# EAGLE schematic FlowControllerNChannel (EAGLE 9.6.2)
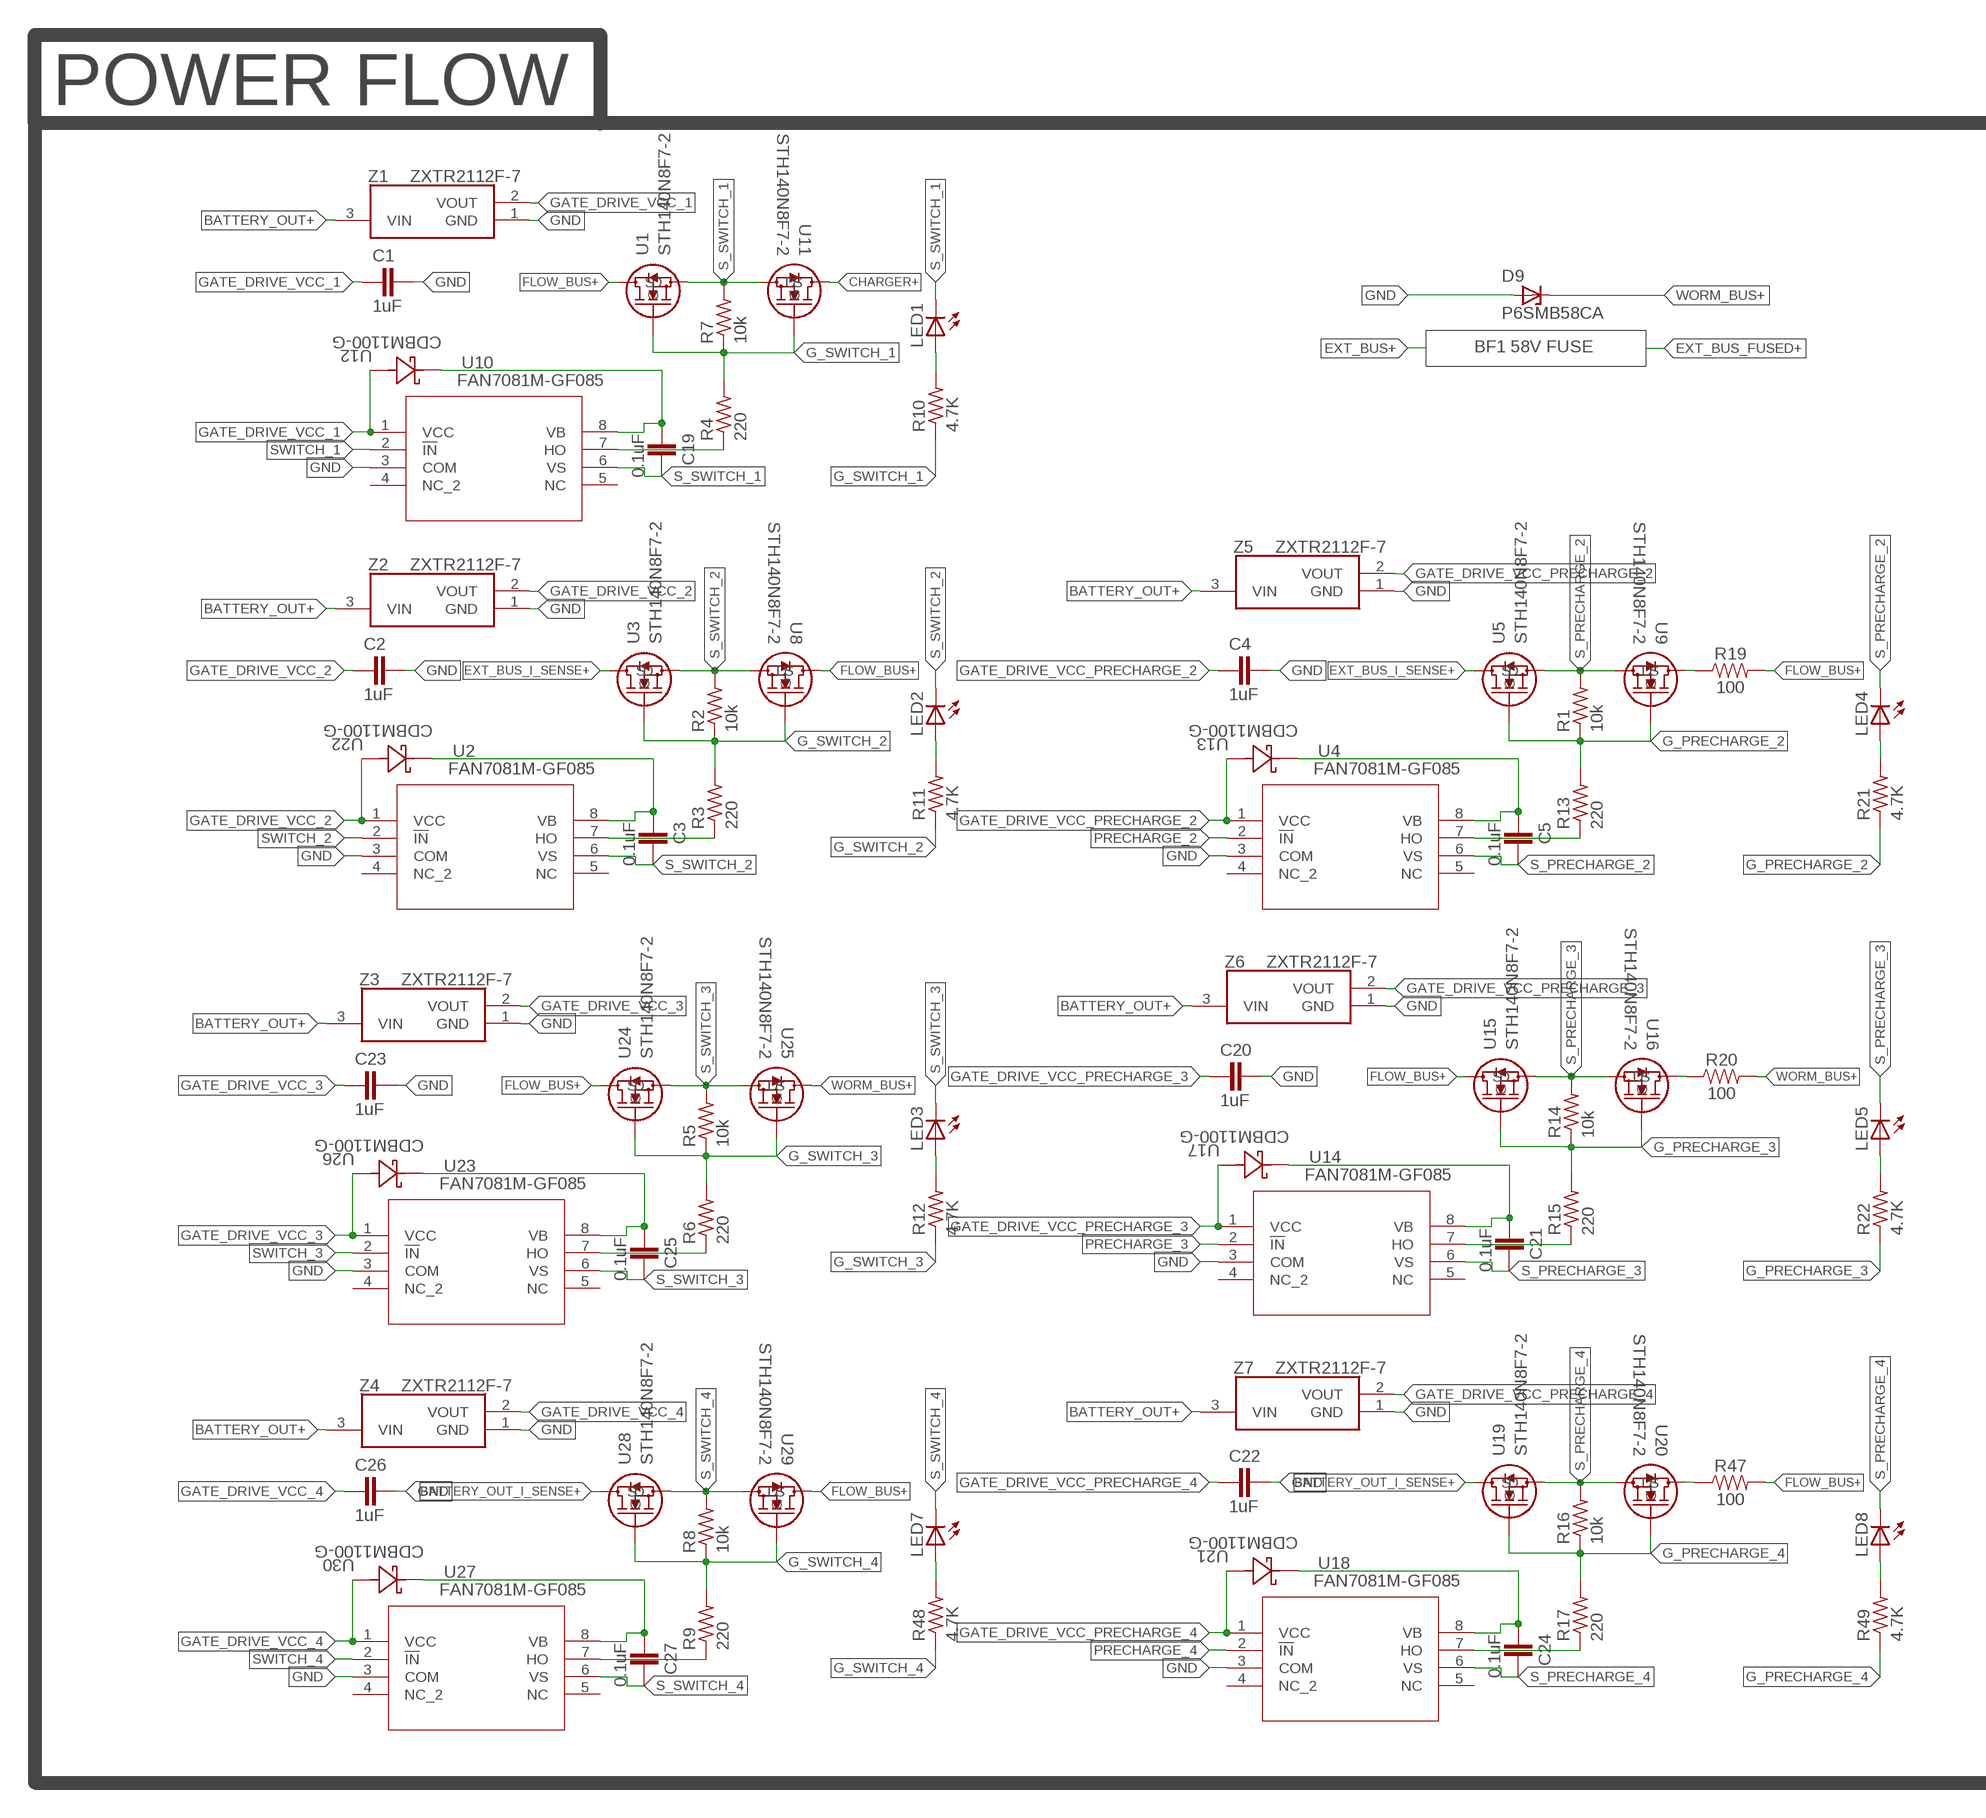
[diagram p0: schematic, sheet 1, part 1 of 2]
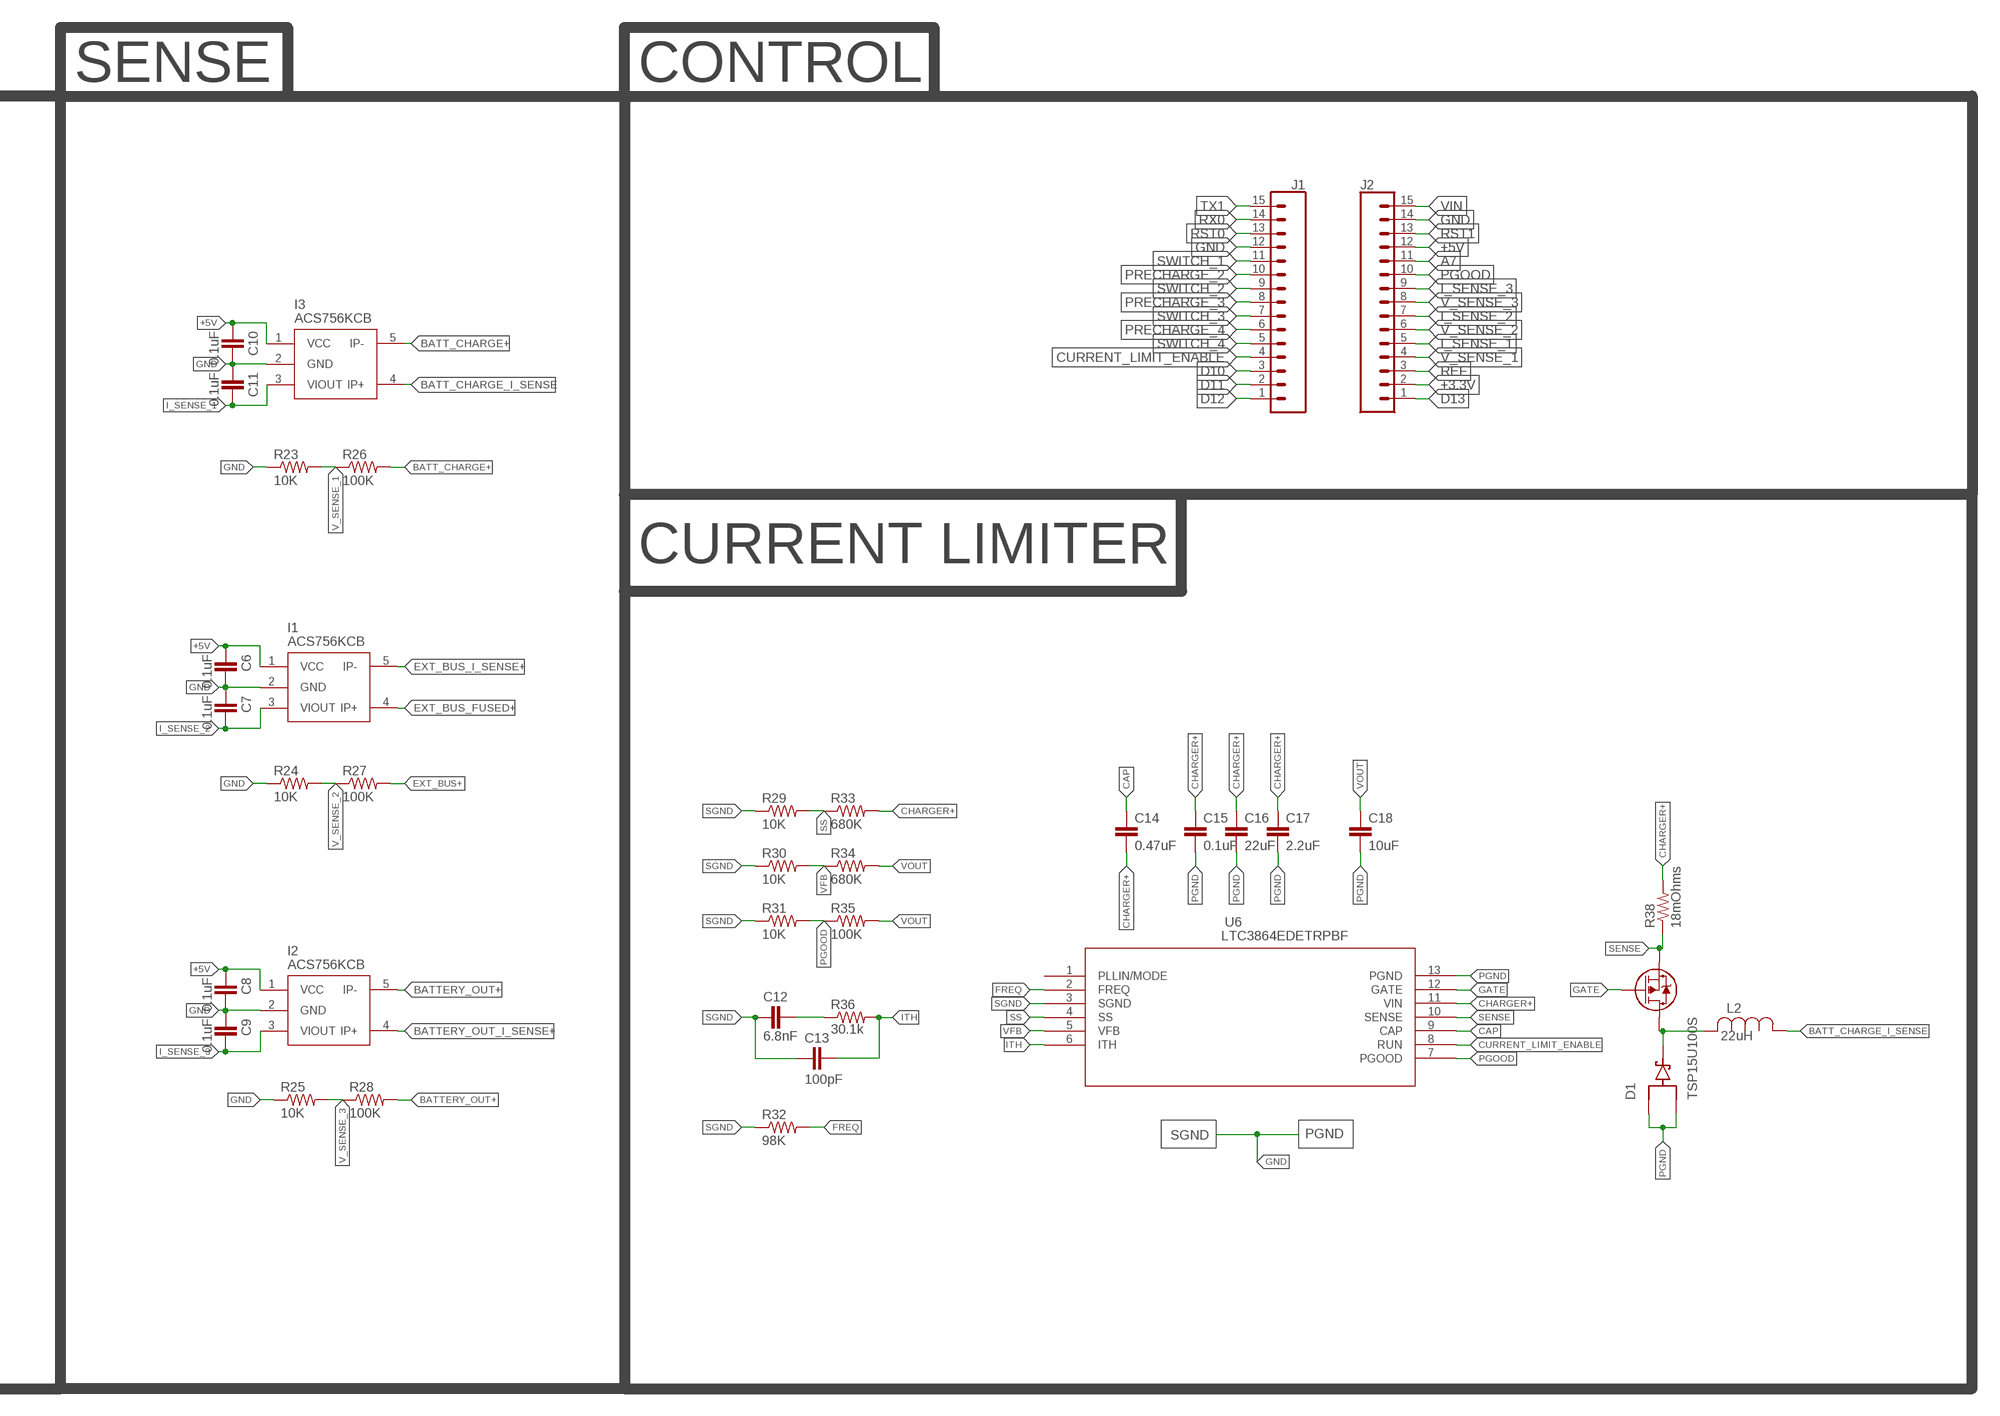
[diagram p1: schematic, sheet 1, part 2 of 2]

## Parts
C1  1uF  2.2UF-0805-25V-(+80/-20%)  [0805]
C2  1uF  2.2UF-0805-25V-(+80/-20%)  [0805]
C3  0.1uF  2.2UF-0805-25V-(+80/-20%)  [0805]
C4  1uF  2.2UF-0805-25V-(+80/-20%)  [0805]
C5  0.1uF  2.2UF-0805-25V-(+80/-20%)  [0805]
C6  0.1uF  2.2UF-0805-25V-(+80/-20%)  [0805]
C7  0.1uF  2.2UF-0805-25V-(+80/-20%)  [0805]
C8  0.1uF  2.2UF-0805-25V-(+80/-20%)  [0805]
C9  0.1uF  2.2UF-0805-25V-(+80/-20%)  [0805]
C10  0.1uF  2.2UF-0805-25V-(+80/-20%)  [0805]
C11  0.1uF  2.2UF-0805-25V-(+80/-20%)  [0805]
C12  6.8nF  2.2UF-0805-25V-(+80/-20%)  [0805]
C13  100pF  2.2UF-0805-25V-(+80/-20%)  [0805]
C14  0.47uF  2.2UF-0805-25V-(+80/-20%)  [0805]
C15  0.1uF  2.2UF-0805-25V-(+80/-20%)  [0805]
C16  22uF  10UF-1210-50V-20%  [1210]
C17  2.2uF  10UF-1210-50V-20%  [1210]
C18  10uF  10UF-1210-50V-20%  [1210]
C19  0.1uF  2.2UF-0805-25V-(+80/-20%)  [0805]
C20  1uF  2.2UF-0805-25V-(+80/-20%)  [0805]
C21  0.1uF  2.2UF-0805-25V-(+80/-20%)  [0805]
C22  1uF  2.2UF-0805-25V-(+80/-20%)  [0805]
C23  1uF  2.2UF-0805-25V-(+80/-20%)  [0805]
C24  0.1uF  2.2UF-0805-25V-(+80/-20%)  [0805]
C25  0.1uF  2.2UF-0805-25V-(+80/-20%)  [0805]
C26  1uF  2.2UF-0805-25V-(+80/-20%)  [0805]
C27  0.1uF  2.2UF-0805-25V-(+80/-20%)  [0805]
D1  TSP15U100S  [DIO_TSP15U100S]
D9  P6SMB58CA  1SMB5913BT3G  [DO214AA]
I1  ACS756KCB  [ACS756KCB]
I2  ACS756KCB  [ACS756KCB]
I3  ACS756KCB  [ACS756KCB]
J1  CONN_15  [1X15]
J2  CONN_15  [1X15]
L2  22uH  IHLP4040DZER6R8M01  [IND_IHLP-4040DZ_VIS]
LED1  LEDCHIPLED_0805  [CHIPLED_0805]
LED2  LEDCHIPLED_0805  [CHIPLED_0805]
LED3  LEDCHIPLED_0805  [CHIPLED_0805]
LED4  LEDCHIPLED_0805  [CHIPLED_0805]
LED5  LEDCHIPLED_0805  [CHIPLED_0805]
LED7  LEDCHIPLED_0805  [CHIPLED_0805]
LED8  LEDCHIPLED_0805  [CHIPLED_0805]
R1  10k  R-US_M0805  [M0805]
R2  10k  R-US_M0805  [M0805]
R3  220  R-US_M0805  [M0805]
R4  220  R-US_M0805  [M0805]
R5  10k  R-US_M0805  [M0805]
R6  220  R-US_M0805  [M0805]
R7  10k  R-US_M0805  [M0805]
R8  10k  R-US_M0805  [M0805]
R9  220  R-US_M0805  [M0805]
R10  4.7K  R-US_M0805  [M0805]
R11  4.7K  R-US_M0805  [M0805]
R12  4.7K  R-US_M0805  [M0805]
R13  220  R-US_M0805  [M0805]
R14  10k  R-US_M0805  [M0805]
R15  220  R-US_M0805  [M0805]
R16  10k  R-US_M0805  [M0805]
R17  220  R-US_M0805  [M0805]
R19  100  0.05OHM-2512-3W-1%  [2512]
R20  100  0.05OHM-2512-3W-1%  [2512]
R21  4.7K  R-US_M0805  [M0805]
R22  4.7K  R-US_M0805  [M0805]
R23  10K  R-US_M0805  [M0805]
R24  10K  R-US_M0805  [M0805]
R25  10K  R-US_M0805  [M0805]
R26  100K  R-US_M0805  [M0805]
R27  100K  R-US_M0805  [M0805]
R28  100K  R-US_M0805  [M0805]
R29  10K  R-US_M0805  [M0805]
R30  10K  R-US_M0805  [M0805]
R31  10K  R-US_M0805  [M0805]
R32  98K  R-US_M0805  [M0805]
R33  680K  R-US_M0805  [M0805]
R34  680K  R-US_M0805  [M0805]
R35  100K  R-US_M0805  [M0805]
R36  30.1k  R-US_M0805  [M0805]
R37  RSJ250P10TL  [TRANS_R5009FNJ_ROM]
R38  18mOhms  R-US_M0805  [M0805]
R47  100  0.05OHM-2512-3W-1%  [2512]
R48  4.7K  R-US_M0805  [M0805]
R49  4.7K  R-US_M0805  [M0805]
U1  STH140N8F7-2  [HPAK_0N8F7-2_STM]
U2  FAN7081M-GF085  [SOIC8_3P9X4P9_ONS]
U3  STH140N8F7-2  [HPAK_0N8F7-2_STM]
U4  FAN7081M-GF085  [SOIC8_3P9X4P9_ONS]
U5  STH140N8F7-2  [HPAK_0N8F7-2_STM]
U6  LTC3864EDETRPBF  [DFN-12_DE]
U8  STH140N8F7-2  [HPAK_0N8F7-2_STM]
U9  STH140N8F7-2  [HPAK_0N8F7-2_STM]
U10  FAN7081M-GF085  [SOIC8_3P9X4P9_ONS]
U11  STH140N8F7-2  [HPAK_0N8F7-2_STM]
U12  CDBM1100-G  [CDBM]
U13  CDBM1100-G  [CDBM]
U14  FAN7081M-GF085  [SOIC8_3P9X4P9_ONS]
U15  STH140N8F7-2  [HPAK_0N8F7-2_STM]
U16  STH140N8F7-2  [HPAK_0N8F7-2_STM]
U17  CDBM1100-G  [CDBM]
U18  FAN7081M-GF085  [SOIC8_3P9X4P9_ONS]
U19  STH140N8F7-2  [HPAK_0N8F7-2_STM]
U20  STH140N8F7-2  [HPAK_0N8F7-2_STM]
U21  CDBM1100-G  [CDBM]
U22  CDBM1100-G  [CDBM]
U23  FAN7081M-GF085  [SOIC8_3P9X4P9_ONS]
U24  STH140N8F7-2  [HPAK_0N8F7-2_STM]
U25  STH140N8F7-2  [HPAK_0N8F7-2_STM]
U26  CDBM1100-G  [CDBM]
U27  FAN7081M-GF085  [SOIC8_3P9X4P9_ONS]
U28  STH140N8F7-2  [HPAK_0N8F7-2_STM]
U29  STH140N8F7-2  [HPAK_0N8F7-2_STM]
U30  CDBM1100-G  [CDBM]
Z1  ZXTR2112F-7  [SOT96P240X110-3N]
Z2  ZXTR2112F-7  [SOT96P240X110-3N]
Z3  ZXTR2112F-7  [SOT96P240X110-3N]
Z4  ZXTR2112F-7  [SOT96P240X110-3N]
Z5  ZXTR2112F-7  [SOT96P240X110-3N]
Z6  ZXTR2112F-7  [SOT96P240X110-3N]
Z7  ZXTR2112F-7  [SOT96P240X110-3N]

## Nets
+3.3V: J2.2
+5V: C6.1 C8.1 C10.1 I1.1(VCC) I2.1(VCC) I3.1(VCC) J2.12
A7: J2.11
BATT_CHARGE+: I3.5(IP-) R26.2
BATT_CHARGE_I_SENSE: I3.4(IP+) L2.1
BATTERY_OUT+: I2.5(IP-) R28.2 Z1.3(VIN) Z2.3(VIN) Z3.3(VIN) Z4.3(VIN) Z5.3(VIN) Z6.3(VIN) Z7.3(VIN)
BATTERY_OUT_I_SENSE+: I2.4(IP+) U19.2(D) U28.2(D)
CAP: C14.1 U6.9(CAP)
CHARGER+: C14.2 C15.1 C16.1 C17.1 R33.2 R38.2 U6.11(VIN) U11.2(D)
CURRENT_LIMIT_ENABLE: J1.4 U6.8(RUN)
D10: J1.3
D11: J1.2
D12: J1.1
D13: J2.1
EXT_BUS+: R27.2
EXT_BUS_FUSED+: I1.4(IP+)
EXT_BUS_I_SENSE+: I1.5(IP-) U3.2(D) U5.2(D)
FLOW_BUS+: R19.P$2 R47.P$2 U1.2(D) U8.2(D) U15.2(D) U24.2(D) U29.2(D)
FREQ: R32.2 U6.2(FREQ)
G_PRECHARGE_2: R1.1 R13.2 R21.1 U5.1(G) U9.1(G)
G_PRECHARGE_3: R14.1 R15.2 R22.1 U15.1(G) U16.1(G)
G_PRECHARGE_4: R16.1 R17.2 R49.1 U19.1(G) U20.1(G)
G_SWITCH_1: R4.2 R7.1 R10.1 U1.1(G) U11.1(G)
G_SWITCH_2: R2.1 R3.2 R11.1 U3.1(G) U8.1(G)
G_SWITCH_3: R5.1 R6.2 R12.1 U24.1(G) U25.1(G)
G_SWITCH_4: R8.1 R9.2 R48.1 U28.1(G) U29.1(G)
GATE: R37.1 U6.12(GATE)
GATE_DRIVE_VCC_1: C1.1 U10.1(VCC) U12.2 Z1.2(VOUT)
GATE_DRIVE_VCC_2: C2.1 U2.1(VCC) U22.2 Z2.2(VOUT)
GATE_DRIVE_VCC_3: C23.1 U23.1(VCC) U26.2 Z3.2(VOUT)
GATE_DRIVE_VCC_4: C26.1 U27.1(VCC) U30.2 Z4.2(VOUT)
GATE_DRIVE_VCC_PRECHARGE_2: C4.1 U4.1(VCC) U13.2 Z5.2(VOUT)
GATE_DRIVE_VCC_PRECHARGE_3: C20.1 U14.1(VCC) U17.2 Z6.2(VOUT)
GATE_DRIVE_VCC_PRECHARGE_4: C22.1 U18.1(VCC) U21.2 Z7.2(VOUT)
GND: C1.2 C2.2 C4.2 C6.2 C7.1 C8.2 C9.1 C10.2 C11.1 C20.2 C22.2 C23.2 C26.2 D9.A I1.2(GND) I2.2(GND) I3.2(GND) J1.12 J2.14 R23.1 R24.1 R25.1 U2.3(COM) U4.3(COM) U10.3(COM) U14.3(COM) U18.3(COM) U23.3(COM) U27.3(COM) Z1.1(GND) Z2.1(GND) Z3.1(GND) Z4.1(GND) Z5.1(GND) Z6.1(GND) Z7.1(GND)
I_SENSE_1: C11.2 I3.3(VIOUT) J2.5
I_SENSE_2: C7.2 I1.3(VIOUT) J2.7
I_SENSE_3: C9.2 I2.3(VIOUT) J2.9
ITH: C13.2 R36.2 U6.6(ITH)
N$1: LED1.A R10.2
N$2: LED8.A R49.2
N$3: LED2.A R11.2
N$5: R13.1 U4.7(HO)
N$6: LED5.A R22.2
N$7: R3.1 U2.7(HO)
N$8: R4.1 U10.7(HO)
N$9: C3.1 U2.8(VB) U22.1
N$10: C5.1 U4.8(VB) U13.1
N$11: C19.1 U10.8(VB) U12.1
N$12: R15.1 U14.7(HO)
N$13: R47.P$1 U20.2(D)
N$14: C21.1 U14.8(VB) U17.1
N$16: R6.1 U23.7(HO)
N$17: LED4.A R21.2
N$18: C25.1 U23.8(VB) U26.1
N$19: R17.1 U18.7(HO)
N$20: R9.1 U27.7(HO)
N$21: C24.1 U18.8(VB) U21.1
N$22: C27.1 U27.8(VB) U30.1
N$23: C12.2 R36.1
N$24: D1.3(K) L2.2 R37.2
N$26: LED3.A R12.2
N$27: LED7.A R48.2
N$33: R19.P$1 U9.2(D)
N$34: R20.P$1 U16.2(D)
PGND: C15.2 C16.2 C17.2 C18.2 D1.1(A1) D1.2(A2) U6.13(PGND)
PGOOD: J2.10 R31.2 R35.1 U6.7(PGOOD)
PRECHARGE_2: J1.10 U4.2(!IN)
PRECHARGE_3: J1.8 U14.2(!IN)
PRECHARGE_4: J1.6 U18.2(!IN)
REF: J2.3
RST0: J1.13
RST1: J2.13
RX0: J1.14
S_PRECHARGE_2: C5.2 LED4.C R1.2 U4.6(VS) U5.3(S) U9.3(S)
S_PRECHARGE_3: C21.2 LED5.C R14.2 U14.6(VS) U15.3(S) U16.3(S)
S_PRECHARGE_4: C24.2 LED8.C R16.2 U18.6(VS) U19.3(S) U20.3(S)
S_SWITCH_1: C19.2 LED1.C R7.2 U1.3(S) U10.6(VS) U11.3(S)
S_SWITCH_2: C3.2 LED2.C R2.2 U2.6(VS) U3.3(S) U8.3(S)
S_SWITCH_3: C25.2 LED3.C R5.2 U23.6(VS) U24.3(S) U25.3(S)
S_SWITCH_4: C27.2 LED7.C R8.2 U27.6(VS) U28.3(S) U29.3(S)
SENSE: R37.3 R38.1 U6.10(SENSE)
SGND: C12.1 C13.1 R29.1 R30.1 R31.1 R32.1 U6.3(SGND)
SS: R29.2 R33.1 U6.4(SS)
SWITCH_1: J1.11 U10.2(!IN)
SWITCH_2: J1.9 U2.2(!IN)
SWITCH_3: J1.7 U23.2(!IN)
SWITCH_4: J1.5 U27.2(!IN)
TX1: J1.15
V_SENSE_1: J2.4 R23.2 R26.1
V_SENSE_2: J2.6 R24.2 R27.1
V_SENSE_3: J2.8 R25.2 R28.1
VFB: R30.2 R34.1 U6.5(VFB)
VIN: J2.15
VOUT: C18.1 R34.2 R35.2
WORM_BUS+: D9.C R20.P$2 U25.2(D)
Unconnected: U2.4(NC_2) U2.5(NC) U4.4(NC_2) U4.5(NC) U6.1(PLLIN/MODE) U10.4(NC_2) U10.5(NC) U14.4(NC_2) U14.5(NC) U18.4(NC_2) U18.5(NC) U23.4(NC_2) U23.5(NC) U27.4(NC_2) U27.5(NC)

## Notes on the sheet
- POWER FLOW | SENSE | CONTROL
- BF1 58V FUSE
- CURRENT LIMITER
- SGND
- PGND

## Library data of the parts
C1-C15 C19-C27 = SparkFun-Capacitors:2.2UF: 2.2µF ceramic capacitors A capacitor is a passive two-terminal electrical component used to store electrical energy temporarily in an electric field.; PROD_ID: CAP-11624; VALUE: 2.2uF
C16 C17 = SparkFun-Capacitors:10UF: 10.0µF ceramic capacitors A capacitor is a passive two-terminal electrical component used to store electrical energy temporarily in an electric field.; PROD_ID: CAP-09824; VALUE: 10uF
C18 = SparkFun-Capacitors:10UF: 10.0µF ceramic capacitors A capacitor is a passive two-terminal electrical component used to store electrical energy temporarily in an electric field.; PROD_ID: CAP-09824
D1 = TSP15U100S:TSP15U100S; DESCRIPTION: 15A, 100V, Trench Schottky; DIGI-KEY_PART_NUMBER: 1801-TSP15U100STR-ND; MF: Taiwan Semiconductor; MP: TSP15U100S; PACKAGE: SMPC Taiwan Semiconductor; PURCHASE-URL: https://pricing.snapeda.com/search/part/TSP15U100S/?ref=eda
D9 = 1smb59xx_10:1SMB59*BT3G: 1SMB59xxBT3G Series 3 Watt Plastic Surface Mount Zener Voltage Regulators Source: http://www.onsemi.com/pub_link/Collateral/1SMB5913BT3-D.PDF; MF: ON Semiconductor; MPN: 1SMB5913BT3G; OC_FARNELL: 1431155; OC_NEWARK: 88H5165
I1-I3 = FlowControllerLib:ACS756KCB
J1 = SparkFun-Connectors:CONN_15: Multi connection point. Often used as Generic Header-pin footprint for 0.1 inch spaced/style header connections On any of the 0.1 inch spaced packages, you can populate with these: Break Away Headers - Straight <https://www.sparkfun.com/products/116> (PRT-00116) Break Away Male Headers - Right Angle <https://www.sparkfun.com/products/553> (PRT-00553) Female Headers <https://www.sparkfun.com/products/115> (PRT-00115) Break Away Headers - Machine Pin <https://www.sparkfun.com/products/117> (PRT-00117) Break Away Female Headers - Swiss Machine Pin <https://www.sparkfun.com/products/743> (PRT-00743) For SCREWTERMINALS and SPRING TERMINALS visit here: Screw Terimnals on SparkFun.com <https://www.sparkfun.com/search/results?term=Screw+Terminals> (5mm/3.5mm/2.54mm spacing) This device is also useful as a general connection point to wire up your design to another part of your project. Our various solder wires solder well into these plated through hole pads. Hook-Up Wire - Assortment (Stranded, 22 AWG) <https://www.sparkfun.com/products/11375> (PRT-11375) Hook-Up Wire - Assortment (Solid Core, 22 AWG) <https://www.sparkfun.com/products/11367> (PRT-11367) View the entire wire category on our website here <https://www.sparkfun.com/categories/141> Special notes: Molex polarized connector foot print use with SKU : PRT-08231 with associated crimp pins and housings. 1MM SMD Version SKU: PRT-10208 NOTES ON THE VARIANTS LOCK and LOCK_LONGPADS... This footprint was designed to help hold the alignment of a through-hole component (i.e. 6-pin header) while soldering it into place. You may notice that each hole has been shifted either up or down by 0.005 of an inch from it's more standard position (which is a perfectly straight line). This slight alteration caused the pins (the squares in the middle) to touch the edges of the holes. Because they are alternating, it causes a "brace" to hold the component in place. 0.005 has proven to be the perfect amount of "off-center" position when using our standard breakaway headers. Although looks a little odd when you look at the bare footprint, once you have a header in there, the alteration is very hard to notice. Also,if you push a header all the way into place, it is covered up entirely on the bottom side.
J2 = SparkFun-Connectors:CONN_15: Multi connection point. Often used as Generic Header-pin footprint for 0.1 inch spaced/style header connections On any of the 0.1 inch spaced packages, you can populate with these: Break Away Headers - Straight <https://www.sparkfun.com/products/116> (PRT-00116) Break Away Male Headers - Right Angle <https://www.sparkfun.com/products/553> (PRT-00553) Female Headers <https://www.sparkfun.com/products/115> (PRT-00115) Break Away Headers - Machine Pin <https://www.sparkfun.com/products/117> (PRT-00117) Break Away Female Headers - Swiss Machine Pin <https://www.sparkfun.com/products/743> (PRT-00743) For SCREWTERMINALS and SPRING TERMINALS visit here: Screw Terimnals on SparkFun.com <https://www.sparkfun.com/search/results?term=Screw+Terminals> (5mm/3.5mm/2.54mm spacing) This device is also useful as a general connection point to wire up your design to another part of your project. Our various solder wires solder well into these plated through hole pads. Hook-Up Wire - Assortment (Stranded, 22 AWG) <https://www.sparkfun.com/products/11375> (PRT-11375) Hook-Up Wire - Assortment (Solid Core, 22 AWG) <https://www.sparkfun.com/products/11367> (PRT-11367) View the entire wire category on our website here <https://www.sparkfun.com/categories/141> Special notes: Molex polarized connector foot print use with SKU : PRT-08231 with associated crimp pins and housings. 1MM SMD Version SKU: PRT-10208 NOTES ON THE VARIANTS LOCK and LOCK_LONGPADS... This footprint was designed to help hold the alignment of a through-hole component (i.e. 6-pin header) while soldering it into place. You may notice that each hole has been shifted either up or down by 0.005 of an inch from it's more standard position (which is a perfectly straight line). This slight alteration caused the pins (the squares in the middle) to touch the edges of the holes. Because they are alternating, it causes a "brace" to hold the component in place. 0.005 has proven to be the perfect amount of "off-center" position when using our standard breakaway headers. Although looks a little odd when you look at the bare footprint, once you have a header in there, the alteration is very hard to notice. Also,if you push a header all the way into place, it is covered up entirely on the bottom side.; SPICEPREFIX: X
L2 = CurrentLimiter:IHLP4040DZER6R8M01; COPYRIGHT: Copyright (C) 2022 Ultra Librarian. All rights reserved.; DIGI-KEY_PART_NUMBER_1: 541-1303-1-ND; DIGI-KEY_PART_NUMBER_2: 541-1303-2-ND; DIGI-KEY_PART_NUMBER_3: 541-1303-6-ND; MANUFACTURER_PART_NUMBER: IHLP4040DZER6R8M01; MFR_NAME: Vishay
LED1-LED5 LED7 LED8 = adafruit:LED: LED OSRAM: - CHIPLED LG R971, LG N971, LY N971, LG Q971, LY Q971, LO R971, LY R971 LH N974, LH R974 LS Q976, LO Q976, LY Q976 LO Q996 - Hyper CHIPLED LW Q18S LB Q993, LB Q99A, LB R99A - SideLED LS A670, LO A670, LY A670, LG A670, LP A670 LB A673, LV A673, LT A673, LW A673 LH A674 LY A675 LS A676, LA A676, LO A676, LY A676, LW A676 LS A679, LY A679, LG A679 - Hyper Micro SIDELED® LS Y876, LA Y876, LO Y876, LY Y876 LT Y87S - SmartLED LW L88C, LW L88S LB L89C, LB L89S, LG L890 LS L89K, LO L89K, LY L89K LS L896, LA L896, LO L896, LY L896 - TOPLED LS T670, LO T670, LY T670, LG T670, LP T670 LSG T670, LSP T670, LSY T670, LOP T670, LYG T670 LG T671, LOG T671, LSG T671 LB T673, LV T673, LT T673, LW T673 LH T674 LS T676, LA T676, LO T676, LY T676, LB T676, LH T676, LSB T676, LW T676 LB T67C, LV T67C, LT T67C, LS T67K, LO T67K, LY T67K, LW E67C LS E67B, LA E67B, LO E67B, LY E67B, LB E67C, LV E67C, LT E67C LW T67C LS T679, LY T679, LG T679 LS T770, LO T770, LY T770, LG T770, LP T770 LB T773, LV T773, LT T773, LW T773 LH T774 LS E675, LA E675, LY E675, LS T675 LS T776, LA T776, LO T776, LY T776, LB T776 LHGB T686 LT T68C, LB T68C - Hyper Mini TOPLED® LB M676 - Mini TOPLED Santana® LG M470 LS M47K, LO M47K, LY M47K Source: http://www.osram.convergy.de/
R1-R17 R21-R36 R38 R48 R49 = adafruit:R-US_: RESISTOR, American symbol
R19 R20 R47 = SparkFun-Resistors:0.05OHM: 0.05Ω resistor A resistor is a passive two-terminal electrical component that implements electrical resistance as a circuit element. Resistors act to reduce current flow, and, at the same time, act to lower voltage levels within circuits. - Wikipedia; PROD_ID: RES-13771; VALUE: 0.05
R37 = CurrentLimiter:RSJ250P10TL; COPYRIGHT: Copyright (C) 2022 Ultra Librarian. All rights reserved.; DIGI-KEY_PART_NUMBER_1: RSJ250P10TLCT-ND; DIGI-KEY_PART_NUMBER_2: RSJ250P10TLDKR-ND; DIGI-KEY_PART_NUMBER_3: RSJ250P10TLTR-ND; MANUFACTURER_PART_NUMBER: RSJ250P10TL; MFR_NAME: ROHM Semiconductor
U1 U3 U5 U8 U9 U11 U15 U16 U19 U20 U24 U25 U28 U29 = FlowControllerLib:STH140N8F7-2; COPYRIGHT: Copyright (C) 2022 Ultra Librarian. All rights reserved.; DIGI-KEY_PART_NUMBER_1: 497-14534-2-ND; DIGI-KEY_PART_NUMBER_2: 497-14534-1-ND; DIGI-KEY_PART_NUMBER_3: 497-14534-6-ND; MANUFACTURER_PART_NUMBER: STH140N8F7-2; MFR_NAME: STMicroelectronics
U2 U4 U10 U14 U18 U23 U27 = FlowControllerLib:FAN7081M-GF085; COPYRIGHT: Copyright (C) 2022 Ultra Librarian. All rights reserved.; DIGI-KEY_PART_NUMBER_1: FAN7081M-GF085-ND; MANUFACTURER_PART_NUMBER: FAN7081M-GF085; MFR_NAME: onsemi
U6 = LTC3864EDETRPBF:LTC3864EDETRPBF; DESCRIPTION: Buck Regulator Positive Output Step-Down - DC-DC Controller IC 12-DFN (4x3); DIGI-KEY_PART_NUMBER: 161-LTC3864EDE#TRPBFTR-ND; MF: Analog Devices; MP: LTC3864EDE#TRPBF; PACKAGE: DFN -12 Analog Devices; PURCHASE-URL: https://pricing.snapeda.com/search/part/LTC3864EDE#TRPBF/?ref=eda
U12 U13 U17 U21 U22 U26 U30 = FlowControllerLib:CDBM1100-G; COPYRIGHT: Copyright (C) 2022 Ultra Librarian. All rights reserved.; DIGI-KEY_PART_NUMBER_1: 641-1331-1-ND; DIGI-KEY_PART_NUMBER_2: 641-1331-2-ND; DIGI-KEY_PART_NUMBER_3: 641-1331-2-NDL; DIGI-KEY_PART_NUMBER_4: 641-1331-6-ND; MANUFACTURER_PART_NUMBER: CDBM1100-G; MFR_NAME: Comchip
Z1-Z7 = SamacSys_Parts:ZXTR2112F-7: Linear Voltage Regulators Transistor Array Zener Linear Reg Source: Datasheet <https://www.diodes.com/assets/Datasheets/ZXTR2112F.pdf>; DESCRIPTION: Linear Voltage Regulators Transistor Array Zener Linear Reg; HEIGHT: 1.1mm; MANUFACTURER_NAME: Diodes Inc.; MANUFACTURER_PART_NUMBER: ZXTR2112F-7; MOUSER_PART_NUMBER: 621-ZXTR2112F-7; MOUSER_PRICE-STOCK: https://www.mouser.co.uk/ProductDetail/Diodes-Incorporated/ZXTR2112F-7?qs=AsTZqt%2FmeqkIS3oif4D14w%3D%3D